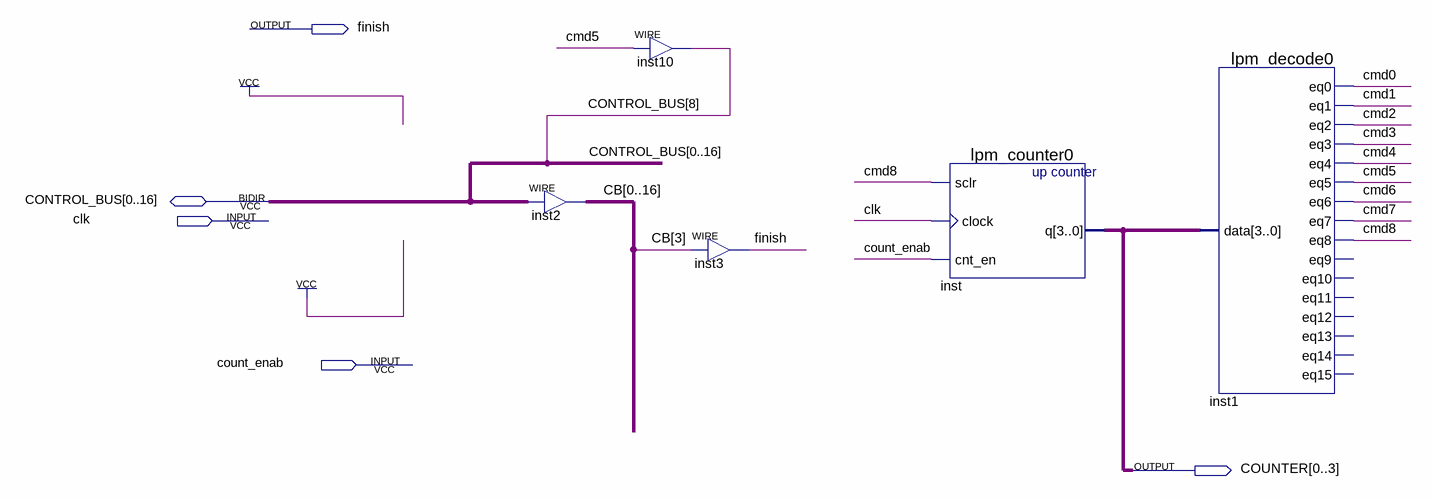
[diagram p0: schematic sheet]
// Quartus schematic CU_2.bdf as structural Verilog: 5 symbols, 5 pins
module CU_2 (
  input  clk,
  input  count_enab,
  inout  [0:16] CONTROL_BUS,
  output finish,
  output [0:3] COUNTER
);

  wire cmd0, cmd1, cmd2, cmd3, cmd4, cmd5, cmd6, cmd7, cmd8;
  wire [16:0] CB;

  assign {CB[0], CB[1], CB[2], CB[3], CB[4], CB[5], CB[6], CB[7], CB[8], CB[9], CB[10], CB[11], CB[12], CB[13], CB[14], CB[15], CB[16]} = CONTROL_BUS;  // WIRE inst2
  assign CONTROL_BUS[8] = cmd5;  // WIRE inst10
  assign finish = CB[3];  // WIRE inst3
  lpm_counter0 inst (.sclr(cmd8), .clock(clk), .cnt_en(count_enab), .q(COUNTER));
  lpm_decode0 inst1 (
    .data(COUNTER), .eq0(cmd0), .eq1(cmd1), .eq2(cmd2), .eq3(cmd3), .eq4(cmd4), .eq5(cmd5), .eq6(cmd6),
    .eq7(cmd7), .eq8(cmd8));  // open: eq9, eq10, eq11, eq12, eq13, eq14, eq15
endmodule
